# Altium schematic sheet R0603.schdoc
size 49 x 27 mm
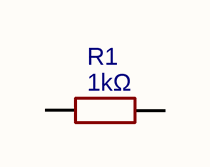
[diagram p0: R0603.schdoc]

## Parts
R1  1kΩ  [R0603]

## Nets

Not connected (* = marked no-connect by the designer): R1 1 2

## Library data of the parts
R1 = 1kΩ: BOM_Manufacturer: FH; BOM_Manufacturer Part: RS-03K102JT; nameAlias: Resistance; Resistance (Ohms): 1K; BOM_Supplier: LCSC; BOM_Supplier Part: C73797; BOM_JLCPCB Part Class: Extended Part; spicePre: R; spiceSymbolName: RS-03K102JT